# Altium schematic sheet main.SchDoc
size C; SheetNumber: 1; SheetTotal: 1
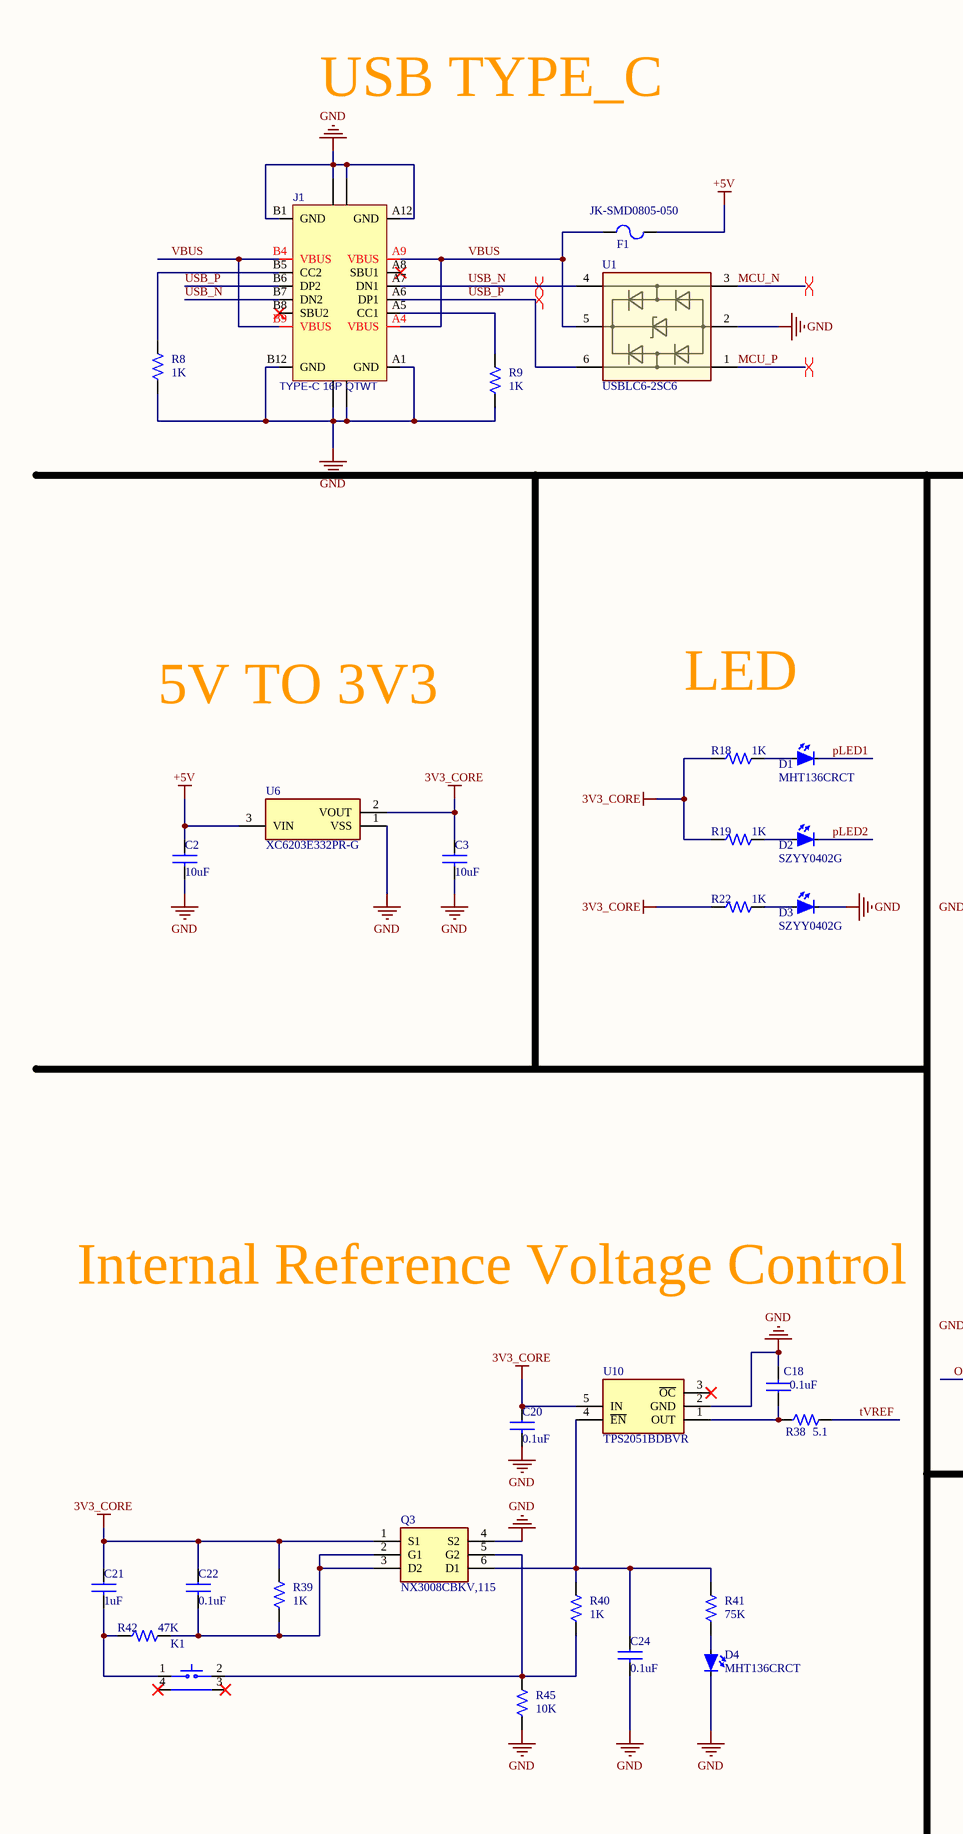
[diagram p0: main.SchDoc, left]
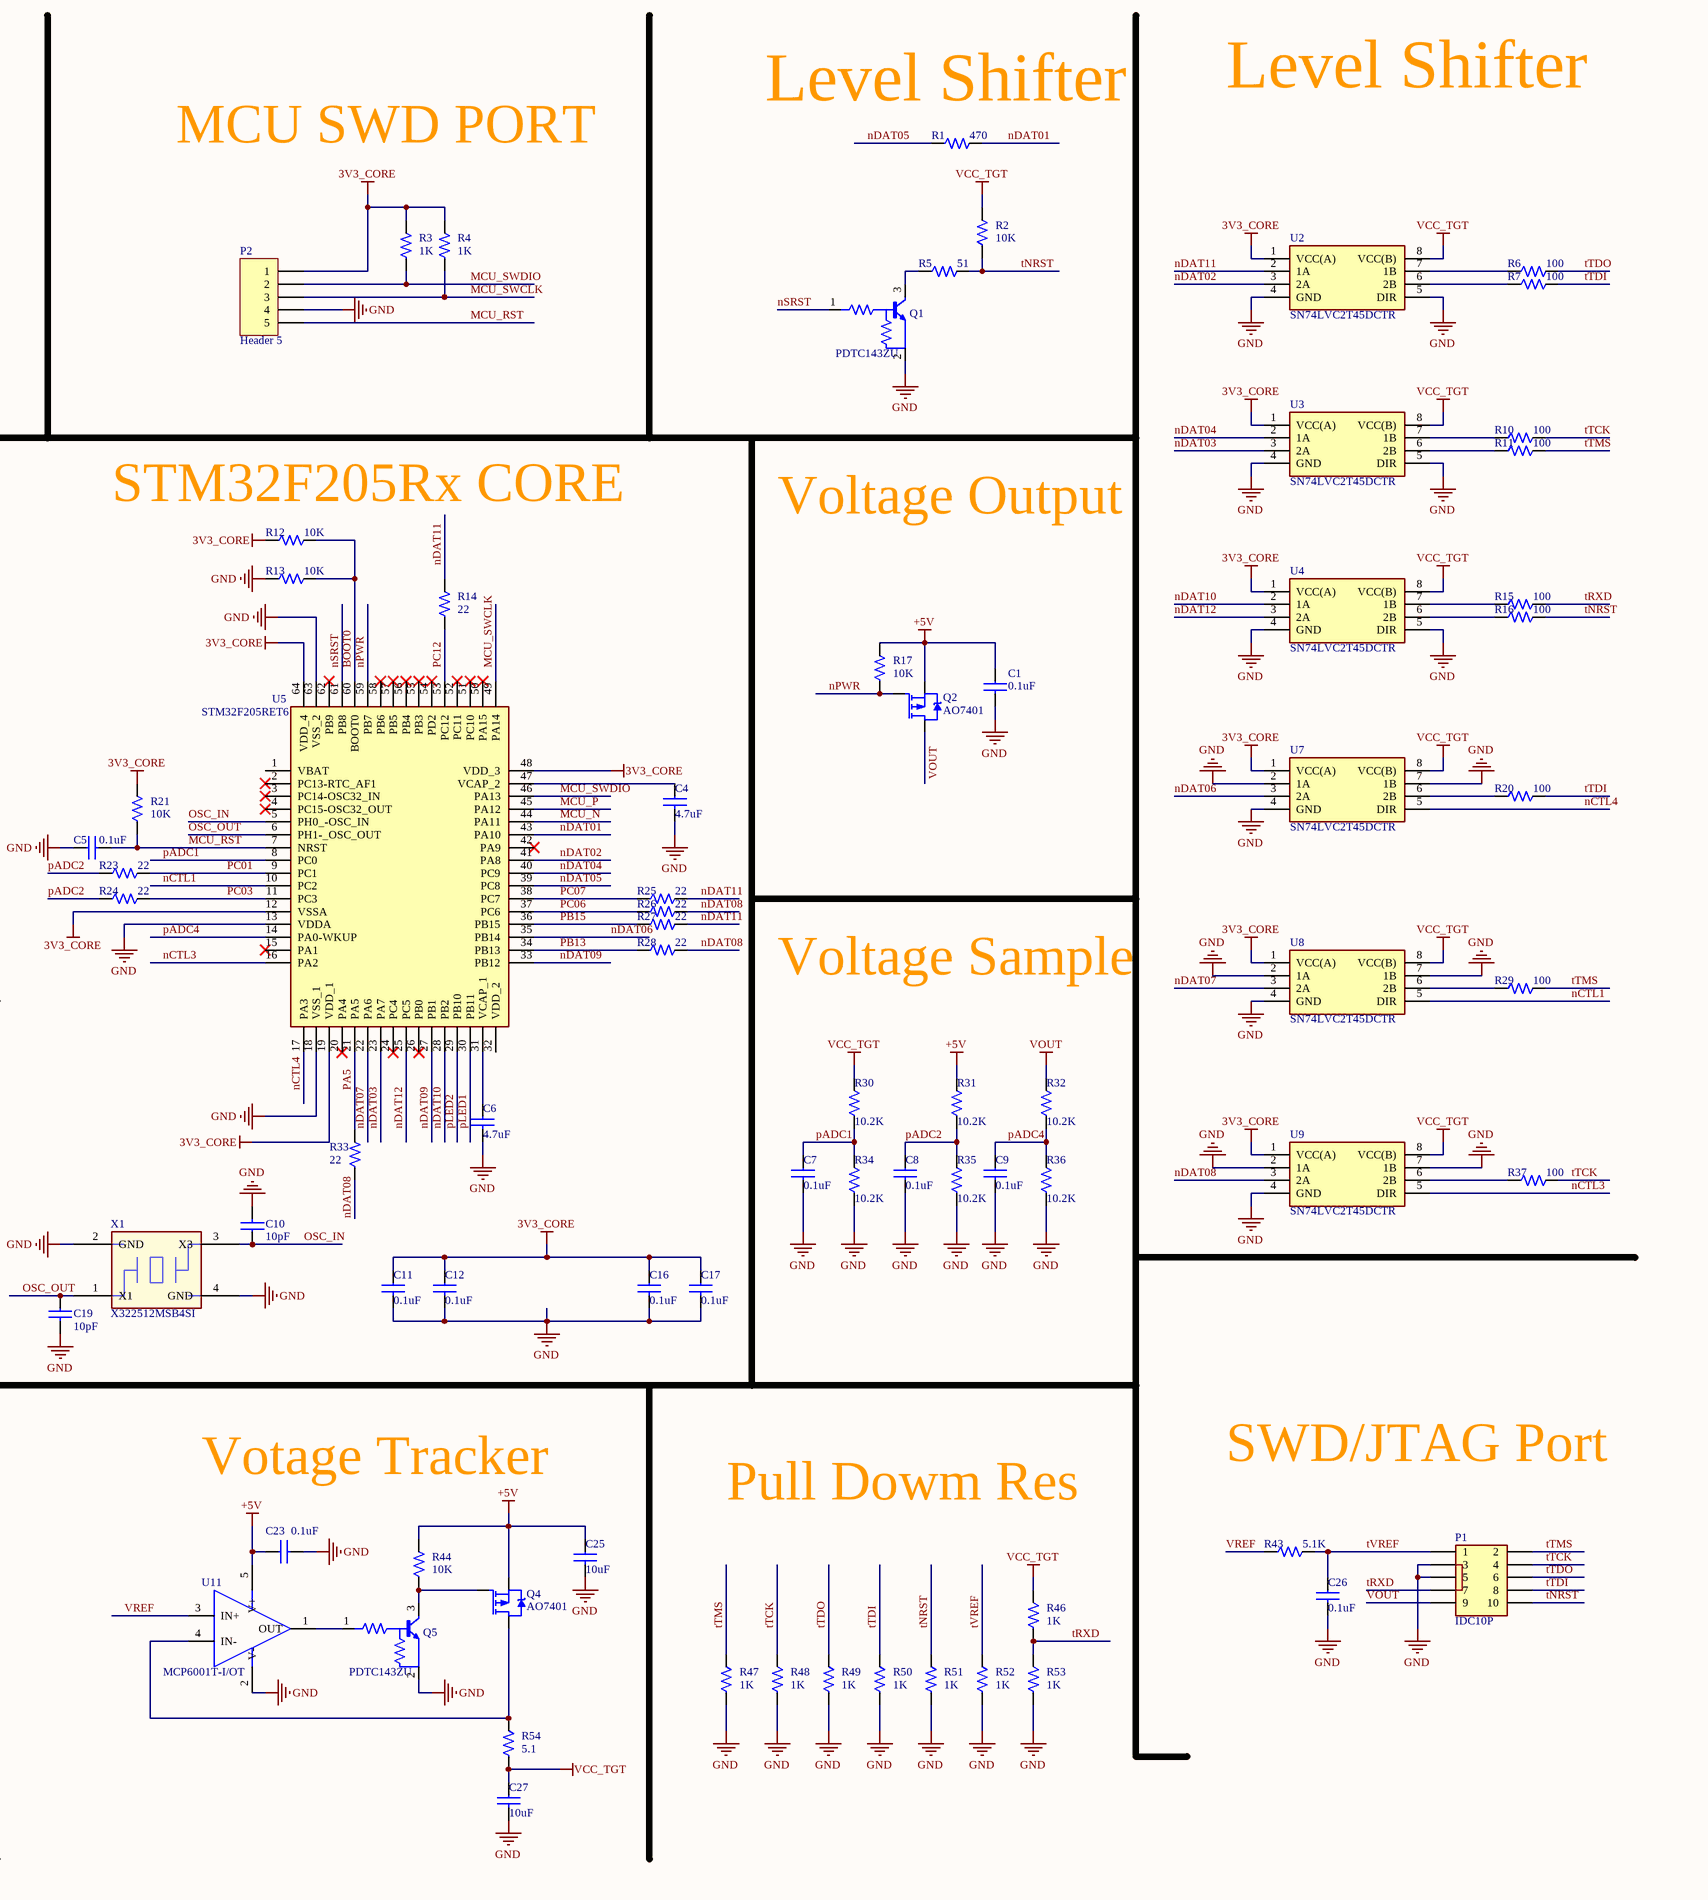
[diagram p1: main.SchDoc, right]

## Parts
C1  0.1uF  [C0402]
C2  10uF  [C0402]
C3  10uF  [C0402]
C4  4.7uF  [C0402]
C5  0.1uF  [C0402]
C6  4.7uF  [C0402]
C7  0.1uF  [C0402]
C8  0.1uF  [C0402]
C9  0.1uF  [C0402]
C10  10pF  [C0402]
C11  0.1uF  [C0402]
C12  0.1uF  [C0402]
C16  0.1uF  [C0402]
C17  0.1uF  [C0402]
C18  0.1uF  [C0402]
C19  10pF  [C0402]
C20  0.1uF  [C0402]
C21  1uF  [C0402]
C22  0.1uF  [C0402]
C23  0.1uF  [C0402]
C24  0.1uF  [C0402]
C25  10uF  [C0402]
C26  0.1uF  [C0402]
C27  10uF  [C0603]
D1  MHT136CRCT  [LED-0402]
D2  SZYY0402G  [LED-0402]
D3  SZYY0402G  [LED-0402]
D4  MHT136CRCT  [LED-0402]
F1  JK-SMD0805-050  [FUSE_0805]
J1  TYPE-C 16P QTWT  [USB-C-16-SM]
K1  TS36CA-0.6  [SW4-3X6X3R5-WS]  (value not drawn)
P1  IDC10P  [IDC10P-2R54-WS]
P2  Device Name  [HDR-1.27-1X5]  (value not drawn)
Q1  PDTC143ZU  [SOT323]  (value not drawn)
Q2  AO7401  [SOT23-3]
Q3  NX3008CBKV,115  [SOT666]
Q4  AO7401  [SOT23-3]
Q5  PDTC143ZU  [SOT323]  (value not drawn)
R1  470  [R0402]
R2  10K  [R0402]
R3  1K  [R0402]
R4  1K  [R0402]
R5  51  [R0402]
R6  100  [R0402]
R7  100  [R0402]
R8  1K  [R0402]
R9  1K  [R0402]
R10  100  [R0402]
R11  100  [R0402]
R12  10K  [R0402]
R13  10K  [R0402]
R14  22  [R0402]
R15  100  [R0402]
R16  100  [R0402]
R17  10K  [R0402]
R18  1K  [R0402]
R19  1K  [R0402]
R20  100  [R0402]
R21  10K  [R0402]
R22  1K  [R0402]
R23  22  [R0402]
R24  22  [R0402]
R25  22  [R0402]
R26  22  [R0402]
R27  22  [R0402]
R28  22  [R0402]
R29  100  [R0402]
R30  10.2K  [R0402]
R31  10.2K  [R0402]
R32  10.2K  [R0402]
R33  22  [R0402]
R34  10.2K  [R0402]
R35  10.2K  [R0402]
R36  10.2K  [R0402]
R37  100  [R0402]
R38  5.1  [R0402]
R39  1K  [R0402]
R40  1K  [R0402]
R41  75K  [R0402]
R42  47K  [R0402]
R43  5.1K  [R0402]
R44  10K  [R0402]
R45  10K  [R0402]
R46  1K  [R0402]
R47  1K  [R0402]
R48  1K  [R0402]
R49  1K  [R0402]
R50  1K  [R0402]
R51  1K  [R0402]
R52  1K  [R0402]
R53  1K  [R0402]
R54  5.1  [R0402]
U1  USBLC6-2SC6  [SOT23-6]
U2  SN74LVC2T45DCTR  [SSOP8]
U3  SN74LVC2T45DCTR  [SSOP8]
U4  SN74LVC2T45DCTR  [SSOP8]
U5  STM32F205RET6  [LQFP64-0R5-10X10]
U6  XC6203E332PR-G  [SOT89]
U7  SN74LVC2T45DCTR  [SSOP8]
U8  SN74LVC2T45DCTR  [SSOP8]
U9  SN74LVC2T45DCTR  [SSOP8]
U10  TPS2051BDBVR  [SOT23-5]
U11  MCP6001T-I/OT  [SOT23-5]
X1  X322512MSB4SI  [3225-4P]

## Nets
3V3_CORE: C3.1 C11.1 C12.1 C16.1 C17.1 C20.1 C21.1 C22.1 P2.1 Q3.1(S1) R3.2 R4.2 R12.1 R18.1 R19.1 R21.2 R22.1 R39.2 U2.1(VCC(A)) U3.1(VCC(A)) U4.1(VCC(A)) U5.12(VSSA) U5.19(VDD_1) U5.48(VDD_3) U5.64(VDD_4) U6.2(VOUT) U7.1(VCC(A)) U8.1(VCC(A)) U9.1(VCC(A)) U10.5(IN)
+5V: C1.1 C2.1 C23.1 C25.1 F1.2 Q2.2(S) Q4.2(S) R17.2 R31.2 R44.2 U6.3(VIN) U11.5(V+)
GND: C1.2 C2.2 C3.2 C4.2 C5.1 C6.2 C7.2 C8.2 C9.2 C10.2 C11.2 C12.2 C16.2 C17.2 C18.2 C19.2 C20.2 C23.2 C24.2 C25.2 C26.2 C27.2 D3.C D4.C J1.0 J1.A1(GND) J1.A12(GND) J1.B1(GND) J1.B12(GND) P1.3 P1.5 P2.4 Q1.2(E) Q3.4(S2) Q5.2(E) R8.1 R9.1 R13.1 R34.1 R35.1 R36.1 R45.1 R47.1 R48.1 R49.1 R50.1 R51.1 R52.1 R53.1 U1.2 U2.4(GND) U2.5(DIR) U3.4(GND) U3.5(DIR) U4.4(GND) U4.5(DIR) U5.13(VDDA) U5.18(VSS_1) U5.63(VSS_2) U6.1(VSS) U7.2(1A) U7.4(GND) U7.7(1B) U8.2(1A) U8.4(GND) U8.7(1B) U9.2(1A) U9.4(GND) U9.7(1B) U10.2(GND) U11.2(V-) X1.2(GND) X1.4(GND)
VCC_TGT: C27.1 R2.2 R30.2 R46.2 R54.1 U2.8(VCC(B)) U3.8(VCC(B)) U4.8(VCC(B)) U7.8(VCC(B)) U8.8(VCC(B)) U9.8(VCC(B))
VOUT: P1.9 Q2.3(D) R32.2
BOOT0: R12.2 R13.2 U5.60(BOOT0)
MCU_N: U1.3 U5.44(PA11)
MCU_P: U1.1 U5.45(PA12)
MCU_RST: C5.2 P2.5 R21.1 U5.7(NRST)
MCU_SWCLK: P2.3 R4.1 U5.49(PA14)
MCU_SWDIO: P2.2 R3.1 U5.46(PA13)
nCTL1: U5.10(PC2) U8.5(DIR)
nCTL3: U5.16(PA2) U9.5(DIR)
nCTL4: U5.17(PA3) U7.5(DIR)
nDAT01: R1.2 U5.43(PA10)
nDAT02: U2.3(2A) U5.41(PA8)
nDAT03: U3.3(2A) U5.23(PA7)
nDAT04: U3.2(1A) U5.40(PC9)
nDAT05: R1.1 U5.39(PC8)
nDAT06: U5.35(PB14) U7.3(2A)
nDAT07: U5.22(PA6) U8.3(2A)
nDAT08: R26.2 R28.2 R33.1 U9.3(2A)
nDAT09: U5.27(PB1) U5.33(PB12)
nDAT10: U4.2(1A) U5.28(PB2)
nDAT11: R14.2 R25.2 R27.2 U2.2(1A)
nDAT12: U4.3(2A) U5.25(PC5)
nPWR: Q2.1(G) R17.1 U5.59(PB7)
nSRST: Q1.1(B) U5.61(PB8)
OSC_IN: C10.1 U5.5(PH0_-OSC_IN) X1.3(X3)
OSC_OUT: C19.1 U5.6(PH1-_OSC_OUT) X1.1(X1)
PA5: R33.2 U5.21(PA5)
pADC1: C7.1 R30.1 R34.2 U5.8(PC0)
pADC2: C8.1 R23.1 R24.1 R31.1 R35.2
pADC4: C9.1 R32.1 R36.2 U5.14(PA0-WKUP)
PB13: R28.1 U5.34(PB13)
PB15: R27.1 U5.36(PB15)
PC01: R23.2 U5.9(PC1)
PC03: R24.2 U5.11(PC3)
PC06: R26.1 U5.37(PC6)
PC07: R25.1 U5.38(PC7)
PC12: R14.1 U5.53(PC12)
pLED1: D1.C U5.30(PB11)
pLED2: D2.C U5.29(PB10)
tNRST: P1.10 R2.1 R5.2 R16.2 R51.2
tRXD: P1.7 R15.2 R46.1 R53.2
tTCK: P1.4 R10.2 R37.2 R48.2
tTDI: P1.8 R7.2 R20.2 R50.2
tTDO: P1.6 R6.2 R49.2
tTMS: P1.2 R11.2 R29.2 R47.2
tVREF: C26.1 P1.1 R38.2 R43.2 R52.2
USB_N: J1.A7(DN1) J1.B7(DN2) U1.4
USB_P: J1.A6(DP1) J1.B6(DP2) U1.6
VBUS: F1.1 J1.A4(VBUS) J1.A9(VBUS) J1.B4(VBUS) J1.B9(VBUS) U1.5
VREF: R43.1 U11.3(IN+)
NetC4_1: C4.1 U5.47(VCAP_2)
NetC6_1: C6.1 U5.31(VCAP_1)
NetC18_1: C18.1 R38.1 U10.1(OUT)
NetC21_2: C21.2 K1.1 R42.1
NetC22_2: C22.2 Q3.2(G1) Q3.3(D2) R39.1 R42.2
NetC24_1: C24.1 Q3.6(D1) R40.2 R41.2 U10.4(~{EN})
NetD1_A: D1.A R18.2
NetD2_A: D2.A R19.2
NetD3_A: D3.A R22.2
NetD4_A: D4.A R41.1
NetJ1_A5: J1.A5(CC1) R9.2
NetJ1_B5: J1.B5(CC2) R8.2
NetK1_2: K1.2 Q3.5(G2) R40.1 R45.2
NetQ1_3: Q1.3(C) R5.1
NetQ4_1: Q4.1(G) Q5.3(C) R44.1
NetQ4_3: Q4.3(D) R54.2 U11.4(IN-)
NetQ5_1: Q5.1(B) U11.1(OUT)
NetR6_1: R6.1 U2.7(1B)
NetR7_1: R7.1 U2.6(2B)
NetR10_1: R10.1 U3.7(1B)
NetR11_1: R11.1 U3.6(2B)
NetR15_1: R15.1 U4.7(1B)
NetR16_1: R16.1 U4.6(2B)
NetR20_1: R20.1 U7.6(2B)
NetR29_1: R29.1 U8.6(2B)
NetR37_1: R37.1 U9.6(2B)

Not connected (* = marked no-connect by the designer): J1 A8(SBU1)* B8(SBU2)*; K1 3* 4*; U5 1(VBAT) 2(PC13-RTC_AF1)* 3(PC14-OSC32_IN)* 4(PC15-OSC32_OUT)* 15(PA1)* 20(PA4)* 24(PC4)* 26(PB0)* 32(VDD_2) 42(PA9)* 50(PA15)* 51(PC10)* 52(PC11)* 54(PD2)* 55(PB3)* 56(PB4)* 57(PB5)* 58(PB6)* 62(PB9)*; U10 3(~{OC})*

## Layout directives
differential pair: MCU_N, MCU_P, USB_N, USB_P

## Notes on the sheet
- USB TYPE_C
- (near R1) Level Shifter
- Level Shifter
- MCU SWD PORT
- (near R12) STM32F205Rx CORE
- Voltage Output
- 5V TO 3V3
- LED
- Voltage Sample
- (near X1) Internal Reference Voltage Control
- SWD/JTAG Port
- Votage Tracker
- Pull Dowm Res

## Library data of the parts
C1 C5 C18 C20 C22 C24 C26 = E01C01711: CAP CER 0.1uF 25V X7R 0402; MPN: GCM155R71E104KE02D; Component: Standard; Tolerance: ±10%; MFG: MURATA; Part Number: E01C01711; ComponentLink1Description: Datasheet; ComponentLink1URL: https://search.murata.co.jp/Ceramy/image/img/A01X/G101/ENG/GCM155R71E104KE02-01.pdf; Part Type: Ceramic; Value: 0.1uF; Power: 25V; Distributor: Digikey; Price: 0.78; Availability: 37,500 - 立即发货; Updated Time: 2019/5/21; Temperature: -55°C ~ 125°C
C2 C3 C25 = E01C02000: CAP CER 10uF 6.3V X5R 0402; MPN: GRM155R60J106ME15D; Component: Standard; Tolerance: ±20%; MFG: MURATA; Part Number: E01C02000; ComponentLink1Description: Datasheet; ComponentLink1URL: https://www.murata.com/~/media/webrenewal/support/library/catalog/products/capacitor/mlcc/c02e.ashx?la=en-us; Part Type: Ceramic; Value: 10uF; Power: 6.3V; Distributor: Digikey; Price: 1.794; Availability: 1,945,937 - 立即发货; Updated Time: 2019/5/21; Temperature: -55°C ~ 85°C
C4 C6 = E01C01942: CAP CER 4.7uF 10V X5R 0402; MPN: GRM155R61A475MEAAD; Component: Standard; Tolerance: ±20%; MFG: MURATA; Part Number: E01C01942; ComponentLink1Description: Datasheet; ComponentLink1URL: https://search.murata.co.jp/Ceramy/image/img/A01X/G101/ENG/GRM155R61A475MEAA-01.pdf; Part Type: Ceramic; Value: 4.7uF; Power: 10V; Distributor: Digikey; Price: 1.794; Availability: 299,667 - 立即发货; Updated Time: 2019/5/21; Temperature: -55°C ~ 85°C
C7-C9 C11 C12 C16 C17 C23 = E01C01713: CAP CER 0.1uF 16V X7R 0402; MPN: GCM155R71C104JA55D; Component: Standard; Tolerance: ±5%; MFG: MURATA; Part Number: E01C01713; ComponentLink1Description: Datasheet; ComponentLink1URL: https://search.murata.co.jp/Ceramy/image/img/A01X/G101/ENG/GCM155R71C104JA55-01.pdf; Part Type: Ceramic; Value: 0.1uF; Power: 16V; Distributor: Digikey; Price: 0.78; Availability: 366,822 - 立即发货; Updated Time: 2019/5/21; Temperature: -55°C ~ 125°C
C10 C19 = E01C00842: CAP CER 10pF 50V C0G/NP0 0402; MPN: GCM1555C1H100JA16D; Component: Standard; Tolerance: ±5%; MFG: MURATA; Part Number: E01C00842; ComponentLink1Description: Datasheet; ComponentLink1URL: https://www.murata.com/~/media/webrenewal/support/library/catalog/products/capacitor/mlcc/c03e.ashx?la=en-us; Part Type: Ceramic; Value: 10pF; Power: 50V; Distributor: Digikey; Price: 0.78; Availability: 934,643 - 立即发货; Updated Time: 2019/5/21; Temperature: -55°C ~ 125°C
C21 = E01C01812: CAP CER 1uF 6.3V X5R 0402; MPN: GRM152R60J105ME15D; Component: Standard; Tolerance: ±20%; MFG: MURATA; Part Number: E01C01812; ComponentLink1Description: Datasheet; ComponentLink1URL: https://search.murata.co.jp/Ceramy/image/img/A01X/G101/ENG/GRM152R60J105ME15-01.pdf; Part Type: Ceramic; Value: 1uF; Power: 6.3V; Distributor: Digikey; Price: 1.95; Availability: 1,417,448 - 立即发货; Updated Time: 2019/5/21; Temperature: -55°C ~ 85°C
C27 = E01C01977: CAP CER 10uF 16V X5R 0603; MPN: GRM188R61C106KAALD; Component: Standard; Tolerance: ±10%; MFG: MURATA; Part Number: E01C01977; ComponentLink1Description: Datasheet; ComponentLink1URL: https://search.murata.co.jp/Ceramy/image/img/A01X/G101/ENG/GRM188R61C106KAAL-01.pdf; Part Type: Ceramic; Value: 10uF; Power: 16V; Distributor: Digikey; Price: 3.042; Availability: 19,377 - 立即发货; Updated Time: 2019/5/21; Temperature: -55°C ~ 85°C
D1 D4 = E01D00051: SMD,发光颜色:红色;功率:60mW;正向电流:5mA;主波长:617.5nm~633.5nm;; MFG: MEIHUA; Component: Standard; Part Number: E01D00051; Part Type: LED; Value: MHT136CRCT; MPN: MHT136CRCT; Distributor: Mouser; Availability: A; ComponentLink1Description: Datasheet
D2 D3 = E01D00010: SMD,发光颜色:翠绿色;; MFG: YONGYU; Component: Standard; Part Number: E01D00010; Part Type: LED; Value: SZYY0402G; MPN: SZYY0402G; Distributor: Szlcsc; Availability: A; ComponentLink1Description: Datasheet
F1 = E01F00003: 0805 0.5A 6V PTC FUSE; MFG: JK; Component: Standard; Part Number: E01F00003; Part Type: Fuse; Value: JK-SMD0805-050; Power: 6V; MPN: JK-SMD0805-050; Distributor: Taobao; Price: 0.02; Availability: A; ComponentLink1Description: Datasheet; ComponentLink1URL: https://item.szlcsc.com/343063.html
J1 = E04C00183: SMD,Type_C母座；16P；卧贴;; MFG: SHOU HAN; Component: Standard; Part Number: E04C00183; Part Type: USB; Value: TYPE-C 16P QTWT; Type: Famale; MPN: TYPE-C 16P QTWT; Distributor: Assmann; Availability: A; ComponentLink1Description: Datasheet
K1 = E01S00008: SMD,轻触开关 3*6*3.5侧按 直径0.6定位柱 白体黑头; Angle: 180°; MFG: SHOU HAN(首韩); Component: Standard; Part Number: E01S00008; Part Type: Switch; Value: TS36CA-0.6; MPN: TS36CA-0.6; Availability: A
P1 = E04C00186: SMD.2.54mm简牛座;卧贴;排数:2;每排PIN数:5; Pitch: 2.54mm; MFG: /; Component: Standard; Part Number: E04C00186; Part Type: Headers; Value: IDC10P; Type: Famale; Distributor: /; Availability: A
P2 = E04C00187: 5脚排针; Value: HDR-1.27-5P; Component: Standard; Manufacture: Device Name; Sch Name: Header 5; Part Number: E04C00187; Part Type: Headers; Availability: A
Q1 Q5 = E01T00045: SMD,预偏置NPN;集射极击穿电压(Vceo):50V;集电极电流(Ic):100mA;功率(Pd):200mW;集电极截止电流(Icbo):1uA;直流电流增益(Hfe@Ic,Vce):100@10mA,5V;; MFG: Nexperia; Component: Standard; Updated Time: 2024:04:06; Part Number: E01T00045; Part Type: NPN; Value: PDTC143ZU; MPN: PDTC143ZU; Availability: A
Q2 Q4 = E01T00044: SMD,漏源电压(Vdss):30V;连续漏极电流(Id):1.4A;功率(Pd):350mW;导通电阻(RDS(on)@Vgs,Id):150mΩ@10V,1.2A;阈值电压(Vgs(th)@Id):1.4V@250uA; MFG: AOS; Component: Standard; Part Number: E01T00044; Part Type: PMOS; Value: AO7401; MPN: AO7401; Availability: A; Temperature: -55℃~+150℃
Q3 = E01T00046: SMD,类型:N沟道+P沟道;漏源电压(Vdss):30V;连续漏极电流(Id):400mA；220mA;功率(Pd):500mW;导通电阻(RDS(on)@Vgs,Id):1.4Ω@350mA,4.5V;阈值电压(Vgs(th)@Id):1.1V@250uA;; MFG: Nexperia; Component: Standard; Updated Time: 2024:04:07; Part Number: E01T00046; Part Type: PMOS_NMOS; Value: NX3008CBKV,115; MPN: NX3008CBKV,115; Availability: A; Temperature: -55℃~+150℃
R1 = E01R01244: RES SMD 470 OHM 5% 1/16W 0402; MPN: RC0402JR-07470RL; Component: Standard; Power: 0.063W，1/16W; MFG: Yageo; Part Number: E01R01244; ComponentLink1Description: Datasheet; ComponentLink1URL: http://www.yageo.com/documents/recent/PYu-RC_Group_51_RoHS_L_10.pdf; Part Type: RES; Value: 470; Tolerance: ±5%; Distributor: Digikey; Price: 0.78; Availability: 2,916,978 - 立即发货; Temperature: -55°C ~ 155°C; Updated Time: 2019/5/21
R2 R12 R13 R17 R21 R44 R45 = E01R01984: RES SMD 10K OHM 1% 1/16W 0402; MPN: RC0402FR-0710KL; Component: Standard; Power: 0.063W，1/16W; MFG: Yageo; Part Number: E01R01984; ComponentLink1Description: Datasheet; ComponentLink1URL: http://www.yageo.com/documents/recent/PYu-RC_Group_51_RoHS_L_10.pdf; Part Type: RES; Value: 10K; Tolerance: ±1%; Distributor: Digikey; Price: 0.78; Availability: 92,091,353 - 立即发货; Temperature: -55°C ~ 155°C; Updated Time: 2019/5/21
R3 R4 R8 R9 R18 R19 R22 R39 R40 R46-R53 = E01R01430: RES SMD 1K OHM 1% 1/16W 0402; MPN: RC0402FR-071KL; Component: Standard; Power: 0.063W，1/16W; MFG: Yageo; Part Number: E01R01430; ComponentLink1Description: Datasheet; ComponentLink1URL: http://www.yageo.com/documents/recent/PYu-RC_Group_51_RoHS_L_10.pdf; Part Type: RES; Value: 1K; Tolerance: ±1%; Distributor: Digikey; Price: 0.78; Availability: 68,900,848 - 立即发货; Temperature: -55°C ~ 155°C; Updated Time: 2019/5/21
R5 = E01R00720: RES SMD 51 OHM 1% 1/16W 0402; MPN: RC0402FR-0751RL; Component: Standard; Power: 0.063W，1/16W; MFG: Yageo; Part Number: E01R00720; ComponentLink1Description: Datasheet; ComponentLink1URL: http://www.yageo.com/documents/recent/PYu-RC_Group_51_RoHS_L_10.pdf; Part Type: RES; Value: 51; Tolerance: ±1%; Distributor: Digikey; Price: 0.78; Availability: 2,118,531 - 立即发货; Temperature: -55°C ~ 155°C; Updated Time: 2019/5/21
R6 R7 R10 R11 R15 R16 R20 R29 R37 = E01R00875: RES SMD 100 OHM 5% 1/16W 0402; MPN: RC0402JR-07100RL; Component: Standard; Power: 0.063W，1/16W; MFG: Yageo; Part Number: E01R00875; ComponentLink1Description: Datasheet; ComponentLink1URL: http://www.yageo.com/documents/recent/PYu-RC_Group_51_RoHS_L_10.pdf; Part Type: RES; Value: 100; Tolerance: ±5%; Distributor: Digikey; Price: 0.78; Availability: 7,389,562 - 立即发货; Temperature: -55°C ~ 155°C; Updated Time: 2019/5/21
R14 R23-R28 R33 = E01R00510: RES SMD 22 OHM 1% 1/16W 0402; MPN: RC0402FR-0722RL; Component: Standard; Power: 0.063W，1/16W; MFG: Yageo; Part Number: E01R00510; ComponentLink1Description: Datasheet; ComponentLink1URL: http://www.yageo.com/documents/recent/PYu-RC_Group_51_RoHS_L_10.pdf; Part Type: RES; Value: 22; Tolerance: ±1%; Distributor: Digikey; Price: 0.78; Availability: 30,606,384 - 立即发货; Temperature: -55°C ~ 155°C; Updated Time: 2019/5/21
R30-R32 R34-R36 = E01R01988: RES SMD 10.2K OHM 1% 1/16W 0402; MPN: RC0402FR-0710K2L; Component: Standard; Power: 0.063W，1/16W; MFG: Yageo; Part Number: E01R01988; ComponentLink1Description: Datasheet; ComponentLink1URL: http://www.yageo.com/documents/recent/PYu-RC_Group_51_RoHS_L_10.pdf; Part Type: RES; Value: 10.2K; Tolerance: ±1%; Distributor: Digikey; Price: 0.78; Availability: 894,412 - 立即发货; Temperature: -55°C ~ 155°C; Updated Time: 2019/5/21
R38 R54 = E01R00242: RES SMD 5.1 OHM 1% 1/16W 0402; MPN: RC0402FR-075R1L; Component: Standard; Power: 0.063W，1/16W; MFG: Yageo; Part Number: E01R00242; ComponentLink1Description: Datasheet; ComponentLink1URL: http://www.yageo.com/documents/recent/PYu-RC_Group_51_RoHS_L_10.pdf; Part Type: RES; Value: 5.1; Tolerance: ±1%; Distributor: Digikey; Price: 0.78; Availability: 534,181 - 立即发货; Temperature: -55°C ~ 155°C; Updated Time: 2019/5/21
R41 = E01R02470: RES SMD 75K OHM 1% 1/16W 0402; MPN: RC0402FR-0775KL; Component: Standard; Power: 0.063W，1/16W; MFG: Yageo; Part Number: E01R02470; ComponentLink1Description: Datasheet; ComponentLink1URL: http://www.yageo.com/documents/recent/PYu-RC_Group_51_RoHS_L_10.pdf; Part Type: RES; Value: 75K; Tolerance: ±1%; Distributor: Digikey; Price: 0.78; Availability: 1,615,244 - 立即发货; Temperature: -55°C ~ 155°C; Updated Time: 2019/5/21
R42 = E01R02353: RES SMD 47K OHM 1% 1/16W 0402; MPN: RC0402FR-0747KL; Component: Standard; Power: 0.063W，1/16W; MFG: Yageo; Part Number: E01R02353; ComponentLink1Description: Datasheet; ComponentLink1URL: http://www.yageo.com/documents/recent/PYu-RC_Group_51_RoHS_L_10.pdf; Part Type: RES; Value: 47K; Tolerance: ±1%; Distributor: Digikey; Price: 0.78; Availability: 11,379,951 - 立即发货; Temperature: -55°C ~ 155°C; Updated Time: 2019/5/21
R43 = E01R01818: RES SMD 5.1K OHM 1% 1/16W 0402; MPN: RC0402FR-075K1L; Component: Standard; Power: 0.063W，1/16W; MFG: Yageo; Part Number: E01R01818; ComponentLink1Description: Datasheet; ComponentLink1URL: http://www.yageo.com/documents/recent/PYu-RC_Group_51_RoHS_L_10.pdf; Part Type: RES; Value: 5.1K; Tolerance: ±1%; Distributor: Digikey; Price: 0.78; Availability: 3,777,303 - 立即发货; Temperature: -55°C ~ 155°C; Updated Time: 2019/5/21
U1 = E02P00418: SMD,USB 2.0高速接口的ESD保护;极性:单向;反向截止电压(Vrwm):5.25V;最大钳位电压:17V;峰值脉冲电流(Ipp)@10/1000us:5A;击穿电压:6V;; MFG: ST; Updated Time: 2024:04:07; Component: Standard; Part Number: E02P00418; Part Type: Interface; Value: USBLC6-2SC6; MPN: USBLC6-2SC6; Distributor: ST; Availability: A; Temperature: -40℃~+125℃
U2-U4 U7-U9 = E02P00290: SMD,数据速率:420Mbps;电压(VCCA):1.2V~5.5V;电压(VCCB):1.2V~5.5V;通道数:2;; MFG: TI; Updated Time: 2024:04:06; Component: Standard; Part Number: E02P00290; Part Type: Logic; Value: SN74LVC2T45DCTR; MPN: 74LVC2T45; Distributor: TI; Availability: A; Temperature: -40℃~+125℃
U5 = E02P00420: SMD,CPU内核:CM3;程序存储容量:512KB;RAM:128KB;GPIO端口数量:51;; Power: 1.8V~3.6V; MFG: ST; Updated Time: 2024:04:07; Component: Standard; Part Number: E02P00420; Part Type: Microcontroller; Value: STM32F205RET6; MPN: STM32F205RET6; Distributor: ST; Availability: A; Temperature: -40℃~+85℃
U6 = E02P00421: SMD,输出类型:固定;最大输入电压:8V;输出电压:3.3V;最大输出电流:400mA;电源纹波抑制比(PSRR):-;输出极性:正极;; Power: 8.0V MAX; MFG: TOREX; Updated Time: 2024:04:08; Component: Standard; Part Number: E02P00421; Part Type: LDO; Value: XC6203E332PR-G; MPN: XC6206; Availability: A; Temperature: -40℃～85℃
U10 = E02P00417: SMD,高电平有效的 0.5A 负载、2.7-5.5V、70mΩ USB 电源开关。; Power: 1V~5.5V; MFG: TI; Updated Time: 2024:04:07; Component: Standard; Part Number: E02P00417; Part Type: DigitalSW; Value: TPS2051BDBVR; MPN: TPS2051; Distributor: TI; Availability: A; Temperature: -40℃~+85℃
U11 = E02P00415: SMD,低功耗单路运算放大器;支持共模输入电压范围为VDD+300mV至VSS-300mV的轨到轨输入和输出摆幅; Power: 1.8V~6V; MFG: MICROCHIP; Updated Time: 2024:04:06; Component: Standard; Part Number: E02P00415; Part Type: AMP; Value: MCP6001T-I/OT; MPN: MCP6001T; Availability: A; Temperature: -40℃~+85℃
X1 = E01X00040: SMD,频率:12MHz;常温频差:±10ppm;外接负载电容:20pF;频率稳定度(全温):±20ppm;; Tolerance: ±20ppm; MFG: YXC; Component: Standard; Part Number: E01X00040; Part Type: OSC; Value: X322512MSB4SI; MPN: X322512MSB4SI; Availability: A